# Altium schematic sheet Accelerometer 2.SchDoc
size A3
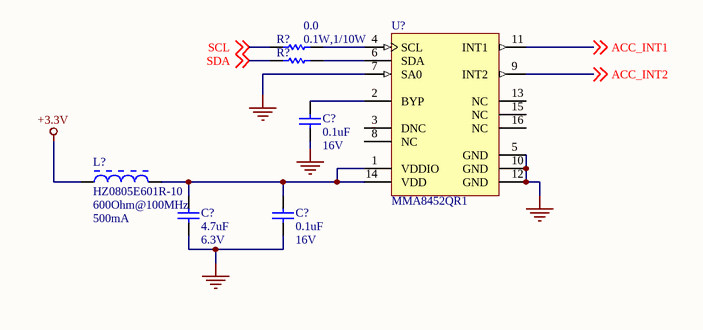
[diagram p0: Accelerometer 2.SchDoc]

## Parts
(Parts that share a designator on the sheet are numbered #1, #2 ... from top to bottom, then left to right.)
C?#1  value 0.1uF  Voltage: 16V  [CAPC1608X87X35ML15T15]  (hidden comment: C0603C104M4RACTU)
C?#2  value 4.7uF  Voltage: 6.3V  [CAPC2013X145X50NL20T25]  (hidden comment: C0805C475K9PACTU)
C?#3  value 0.1uF  Voltage: 16V  [CAPC1608X87X35ML15T15]  (hidden comment: C0603C104M4RACTU)
L?  HZ0805E601R-10  Impedance @ Frequency: 600Ohm@100MHz  Current Rating (Max): 500mA  [LIRD-LI0805H151R-10-2_V]
R?#1  value 0.0  Power: 0.1W,1/10W  [RESC1608X55X35LL10T10]  (hidden comment: RC1608J000CS)
R?#2  RC1608J000CS  [RESC1608X55X35LL10T10]  (value not drawn)
U?  MMA8452QR1  [FREE-QFN-16_V]

## Nets
+3.3V: L?.1
GND: C?#1.1 C?#2.1 C?#3.1 U?.5(GND) U?.7(SA0) U?.10(GND) U?.12(GND)
ACC_INT1: U?.11(INT1) ; off-sheet ACC_INT1
ACC_INT2: U?.9(INT2) ; off-sheet ACC_INT2
SCL: R?#1.1 ; off-sheet SCL
SDA: R?#2.1 ; off-sheet SDA
NetC?#1_2: C?#1.2 U?.2(BYP)
NetC?#2_2: C?#2.2 C?#3.2 L?.2 U?.1(VDDIO) U?.14(VDD)
NetR?#1_2: R?#1.2 U?.4(SCL)
NetR?#2_2: R?#2.2 U?.6(SDA)

Not connected (* = marked no-connect by the designer): U? 3(DNC) 8(NC) 13(NC) 15(NC) 16(NC)

## Notes on the sheet
- Title
- Size:
- Date:
- A3
- Number:
- Time:
- Revision:
- Sheet
- of
- File:

## Library data of the parts
C?#1 C?#3 = CMP-2006-03067-1: Ceramic Capacitor 0.1uF 16V +-10% X7R0603; Manufacturer: Kemet; Alternative1: C1608X7R1E104K TDK; Alternative2: CC0603KRX7R8BB104 Yageo; Alternative3: GRM188R72A104KA35D Murata; Part Number: C0603C104M4RACTU; Package / Case: 0603
C?#2 = CMP-2007-01009-1: Manufacturer: Kemet; Alternative1: GRM219R61A475KE34D Murata; Alternative2: C0805C475K3PACTU KEMET; Alternative3: CC0805KKX5R7BB475 Yageo; Part Number: C0805C475K9PACTU; Package / Case: 0805
L? = CMP-2000-05194-1: Chip Bead for Signal Filtering, 600 Ohm, 500 mA, -40 to 125 degC, 0805 (2012 Metric), RoHS, Tape and Reel; Manufacturer: Laird; Other Names: 240-2399-1; Kits: 240-2227-ND-KITEMIFERRITEBEADCHIPSMD; DC Resistance (DCR) (Max): 300mOhm; Filter Type: SignalLine; Operating Temperature: -40degC~125degC; Datasheet URL: https://datasheet.ciiva.com/22622/1685710-22622833.pdf; Mounting Type: SurfaceMount; Package / Case: 0805(2012Metric); Package Description: 2-Pin Surface Mount Device, Body 2 x 1.25 mm; Package Reference: LI0805H15R-10-2; Size / Dimension: 0.079"Lx0.049"W(2.00mmx1.25mm); Height (Max): 0.043"(1.10mm); Part Number: HZ0805E601R-10
R?#1 = CMP-2000-06972-1: Chip Resistor, 0 Ohm, +/- 5%, 0.1 W, -55 to 155 degC, 0603 (1608 Metric), RoHS, Tape and Reel; Manufacturer: Samsung-Electro-Mechanics-America,-Inc.; Tolerance: Jumper; Alternative1: RC0603JR-130RL Yageo; Alternative2: RC0603JR-100RL Yageo; Alternative3: CRCW0603-0000Z0EA Vishay; Manufacturer URL: http://www.samsungsem.com/global/index.jsp; Features: MoistureResistant; Mounting Technology: SurfaceMount; Series: RC; Package / Case: 0603(1608Metric); Category: Resistors; Operating Temperature: -55°C~155°C; Datasheet URL: http://static6.arrow.com/aropdfconversion/3cece72dd289ffbadc164fbcd05f638dd7240f7b/rc_datasheet_150330.pdf.pdf?authToken=eyJ0eXAiOiJKV1QiLCJhbGciOiJIUzI1NiJ9.eyJTZXNzaW9uSWQiOiJtY3ZlYXdxYmptZXdpdXdyeG1ha2FxdWciLCJEb3dubG9hZFR5cGUiOiJEYXRhc2hlZXRzIiwiaXNzIjoic2VsZiIsImF1ZCI6Imh0dHA6Ly9kYXRhc2hlZXRhdXRoLmFycm93LmNvbSIsImV4cCI6MTQ3Njg1OTQ5NiwibmJmIjoxNDc2ODU5Mzc2fQ.1rZWSrRNyHkP6J5YmszFzS2kzmlbN9BKNvWJ4ACiP-Q; Datasheet Version: 09/2015; Composition: ThickFilm; Package Description: 2-Pin Chip Resistor, Body 1.6 x 0.8 mm; Height: 0.022"(0.55mm); Family: ChipResistor-SurfaceMount; Temperature Coefficient: -; Size / Dimension: 0.063"Lx0.031"W(1.60mmx0.80mm); Part Number: RC1608J000CS
R?#2 = CMP-2000-06972-1: Chip Resistor, 0 Ohm, +/- 5%, 0.1 W, -55 to 155 degC, 0603 (1608 Metric), RoHS, Tape and Reel; Manufacturer: Samsung-Electro-Mechanics-America,-Inc.; Power: 0.1W,1/10W; Value: 0.0; Tolerance: Jumper; Alternative1: RC0603JR-130RL Yageo; Alternative2: RC0603JR-100RL Yageo; Alternative3: CRCW0603-0000Z0EA Vishay; Manufacturer URL: http://www.samsungsem.com/global/index.jsp; Features: MoistureResistant; Mounting Technology: SurfaceMount; Series: RC; Package / Case: 0603(1608Metric); Category: Resistors; Operating Temperature: -55°C~155°C; Datasheet URL: http://static6.arrow.com/aropdfconversion/3cece72dd289ffbadc164fbcd05f638dd7240f7b/rc_datasheet_150330.pdf.pdf?authToken=eyJ0eXAiOiJKV1QiLCJhbGciOiJIUzI1NiJ9.eyJTZXNzaW9uSWQiOiJtY3ZlYXdxYmptZXdpdXdyeG1ha2FxdWciLCJEb3dubG9hZFR5cGUiOiJEYXRhc2hlZXRzIiwiaXNzIjoic2VsZiIsImF1ZCI6Imh0dHA6Ly9kYXRhc2hlZXRhdXRoLmFycm93LmNvbSIsImV4cCI6MTQ3Njg1OTQ5NiwibmJmIjoxNDc2ODU5Mzc2fQ.1rZWSrRNyHkP6J5YmszFzS2kzmlbN9BKNvWJ4ACiP-Q; Datasheet Version: 09/2015; Composition: ThickFilm; Package Description: 2-Pin Chip Resistor, Body 1.6 x 0.8 mm; Height: 0.022"(0.55mm); Family: ChipResistor-SurfaceMount; Temperature Coefficient: -; Size / Dimension: 0.063"Lx0.031"W(1.60mmx0.80mm); Part Number: RC1608J000CS
U? = CMP-1750-00003-1: 3-Axis, 12-Bit / 8-Bit Digital Acceleromete, 1.95 to 3.6 V, -40 to 85 degC, 16-Pin QFN, RoHS, Tape and Reel; Elements: 1; Nominal Vgs: -3.5 V; Typical Rise Time: 8 ns; Nominal Dual Supply Voltage: -60 V; Rds On Max: 14 Ohm; Input Capacitance: 50 pF; Case\Package: TO-226-3; Max Power Dissipation: 625 mW; ComponentLink1URL: http://www.nxp.com/; ComponentLink2URL: http://cache.nxp.com/files/sensors/doc/data_sheet/MMA8452Q.pdf; ComponentLink2Description: Datasheet; Length: 4.77 mm; ComponentLink1Description: Manufacturer URL; Mount: Through Hole; REACH SVHC: No SVHC; Packaging: Bulk; PackageReference: QFN-16; Max Operating Temperature: 150 degC; Min Operating Temperature: -55 degC; Height: 4.01 mm; Pins: 3; Radiation Hardening: No; Weight: 0.016 oz; RoHSCompliant: true; Width: 2.41 mm; Package Quantity: 4000; PackageDescription: 16-Pin Quad Flat No-lead Package, Body 3 x 3 mm , Pitch 0.5 mm; DatasheetVersion: Rev. 10, 04/2016